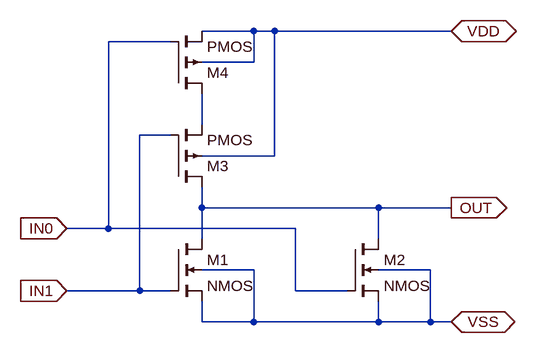
[diagram p0: schematic 2NOR.asc]
2NOR.asc, the LTspice schematic file:
Version 4
SHEET 1 880 680
WIRE 256 -96 176 -96
WIRE 288 -96 256 -96
WIRE 560 -96 288 -96
WIRE 128 -80 32 -80
WIRE 256 -48 256 -96
WIRE 256 -48 176 -48
WIRE 176 48 176 0
WIRE 128 64 80 64
WIRE 288 96 288 -96
WIRE 288 96 176 96
WIRE 176 176 176 144
WIRE 448 176 176 176
WIRE 560 176 448 176
WIRE 32 208 32 -80
WIRE 32 208 -32 208
WIRE 320 208 32 208
WIRE 176 224 176 176
WIRE 448 224 448 176
WIRE 256 272 176 272
WIRE 528 272 448 272
WIRE 80 304 80 64
WIRE 80 304 -32 304
WIRE 128 304 80 304
WIRE 320 304 320 208
WIRE 400 304 320 304
WIRE 176 352 176 320
WIRE 256 352 256 272
WIRE 256 352 176 352
WIRE 448 352 448 320
WIRE 448 352 256 352
WIRE 528 352 528 272
WIRE 528 352 448 352
WIRE 560 352 528 352
FLAG 560 176 OUT
IOPIN 560 176 Out
FLAG 560 -96 VDD
IOPIN 560 -96 BiDir
FLAG 560 352 VSS
IOPIN 560 352 BiDir
FLAG -32 208 IN0
IOPIN -32 208 In
FLAG -32 304 IN1
IOPIN -32 304 In
SYMBOL nmos4 128 224 R0
SYMATTR InstName M1
SYMATTR Value2 l=110u w=180u
SYMBOL nmos4 400 224 R0
SYMATTR InstName M2
SYMATTR Value2 l=110u w=180u
SYMBOL pmos4 128 144 M180
SYMATTR InstName M3
SYMATTR Value2 l=110u w=180u
SYMBOL pmos4 128 0 M180
SYMATTR InstName M4
SYMATTR Value2 l=110u w=180u

The netlist it stands for:
* 2NOR.asc
M1 OUT IN1 VSS VSS NMOS l=110u w=180u
M2 OUT IN0 VSS VSS NMOS l=110u w=180u
M3 OUT IN1 N001 VDD PMOS l=110u w=180u
M4 N001 IN0 VDD VDD PMOS l=110u w=180u
.model NMOS NMOS
.model PMOS PMOS
.lib standard.mos
.backanno
.end